# EAGLE design TZXDUINO (EAGLE 9.6.1)
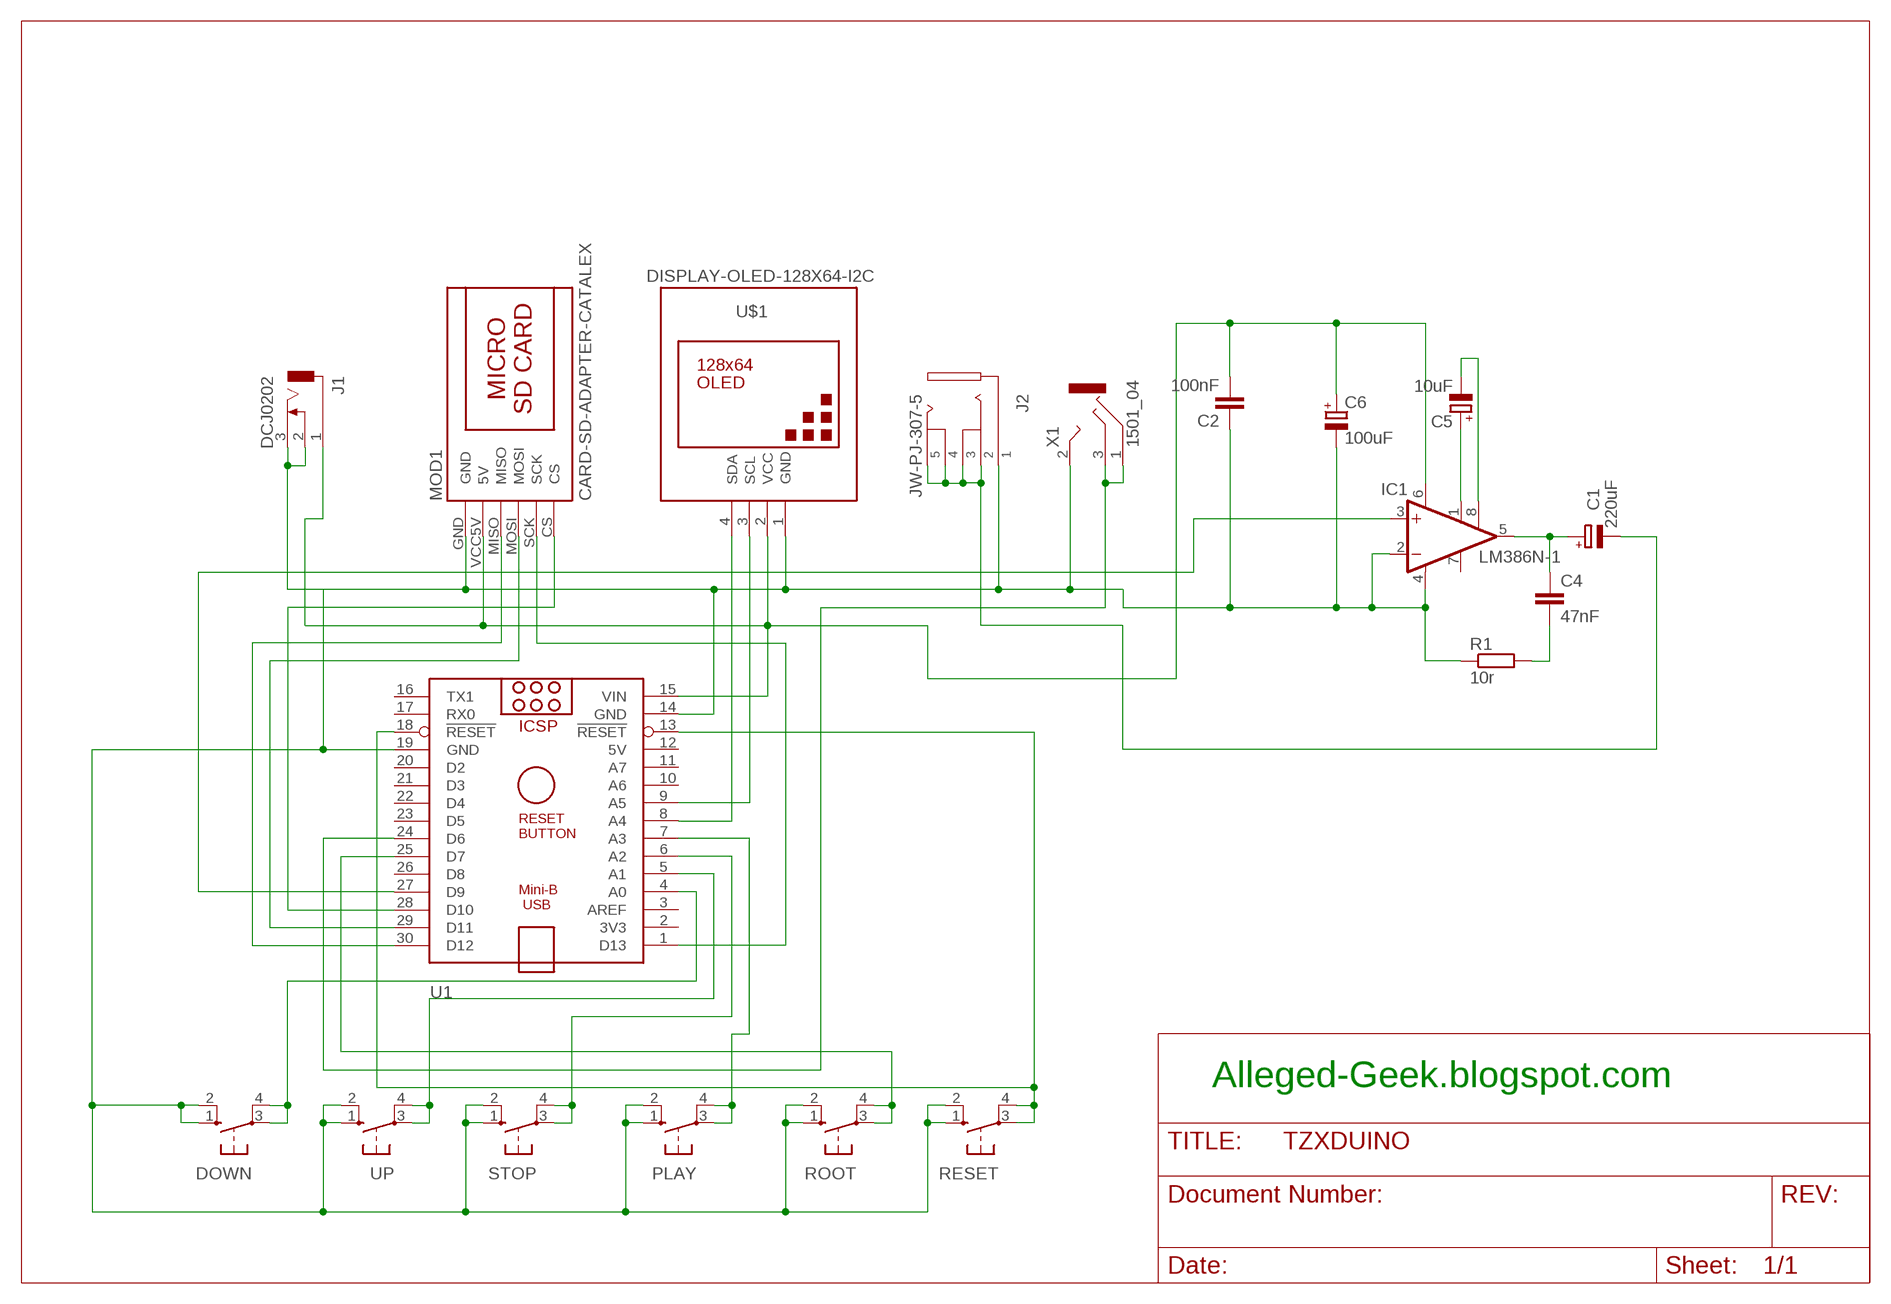
[diagram p0: schematic, sheet 1]

## Parts
C1  220uF  RGU-470UF-POLARCAP  [E3,5-8]
C2  100nF  RGU-CAPACITOR-CEU-50-25-75(100NF)  [C050-025X075]
C4  47nF  RGU-CAPACITOR-CEU-50-25-75(100NF)  [C050-025X075]
C5  10uF  RGU-10-100UF-POLARCAP  [E2,5-5]
C6  100uF  RGU-10-100UF-POLARCAP  [E2,5-5]
DOWN  10-XX  [B3F-10XX]
IC1  LM386N-1  [DIL08]
J1  DCJ0202  [DCJ0202]
J2  JW-PJ-307-5  [JW-PJ-307-5]
MOD1  CARD-SD-ADAPTER-CATALEX  [CARD-SD-ADAPTER-CATALEX]
PLAY  10-XX  [B3F-10XX]
R1  10r  RGU-RESISTOR-207/10  [0207/10]
RESET  10-XX  [B3F-10XX]
ROOT  10-XX  [B3F-10XX]
STOP  10-XX  [B3F-10XX]
U1  RGU-ARDUINONANO-SHIELD  [ARDUINO_NANO]
U$1  DISPLAY-OLED-128X64-I2C  [DISPLAY-OLED-128X64-I2C]
UP  10-XX  [B3F-10XX]
X1  1501_04  [1501_05]

## Nets
N$1: RESET.3(P) RESET.4(P1) U1.13(!RESET) U1.18(!RESET)
N$2: U1.8(A4) U$1.4(SDA)
N$3: C2.2 C6.+ IC1.6(VS) J1.1 MOD1.VCC5V(5V) U1.15(VIN) U$1.2(VCC)
N$4: MOD1.CS U1.28(D10)
N$5: MOD1.SCK U1.1(D13)
N$6: C1.- J2.2 J2.3 J2.4 J2.5
N$7: MOD1.MOSI U1.29(D11)
N$8: U1.9(A5) U$1.3(SCL)
N$9: MOD1.MISO U1.30(D12)
N$10: C2.1 C6.- DOWN.1(S) DOWN.2(S1) IC1.2(-IN) IC1.4(GND) J1.2 J1.3 J2.1 MOD1.GND PLAY.1(S) PLAY.2(S1) R1.1 RESET.1(S) RESET.2(S1) ROOT.1(S) ROOT.2(S1) STOP.1(S) STOP.2(S1) U1.14(GND) U1.19(GND) U$1.1(GND) UP.1(S) UP.2(S1) X1.2
N$11: DOWN.3(P) DOWN.4(P1) U1.4(A0)
N$12: U1.5(A1) UP.3(P) UP.4(P1)
N$13: STOP.3(P) STOP.4(P1) U1.6(A2)
N$14: PLAY.3(P) PLAY.4(P1) U1.7(A3)
N$15: ROOT.3(P) ROOT.4(P1) U1.25(D7)
N$17: IC1.3(+IN) U1.27(D9)
N$19: C5.+ IC1.1(GAIN)
N$20: C1.+ C4.1 IC1.5(OUT)
N$21: C4.2 R1.2
N$22: C5.- IC1.8(GAIN)
N$23: U1.24(D6) X1.1 X1.3
Unconnected: IC1.7(BYPASS) U1.2(3V3) U1.3(AREF) U1.10(A6) U1.11(A7) U1.16(TX1) U1.17(RX0) U1.20(D2) U1.21(D3) U1.22(D4) U1.23(D5) U1.26(D8)

## Notes on the sheet
- Alleged-Geek.blogspot.com

## Power pins joined to a net without a drawn wire
5V: U1.12(5V)

## Library data of the parts
C1 = RGU-StoresParts:RGU-470UF-POLARCAP
C2 C4 = RGU-StoresParts:RGU-CAPACITOR-CEU-50-25-75(100NF)
C5 C6 = RGU-StoresParts:RGU-10-100UF-POLARCAP
DOWN PLAY RESET ROOT STOP UP = switch-omron:10-XX: OMRON SWITCH; MPN: B3F-1000; OC_FARNELL: 176432; OC_NEWARK: 36M3542
IC1 = linear:LM386?-*: Low Voltage Audio Power Amplifier Source: http://cache.national.com/ds/LM/LM386.pdf
J1 = con-jack:DCJ0202: DC POWER JACK Source: DCJ0202.pdf; OC_FARNELL: unknown; OC_NEWARK: unknown
J2 = HeadphoneJack:JW-PJ-307-5
MOD1 = SD-Card-Module_CATALEX:CARD-SD-ADAPTER-CATALEX: Micro SD Card Adapter Module with onboard 3.3V regulator
R1 = RGU-StoresParts:RGU-RESISTOR-207/10
U1 = RGU-StoresParts:RGU-ARDUINONANO-SHIELD; MF: Rapid; MPN: 73-4448
U$1 = diy-modules:DISPLAY-OLED-128X64-I2C: 128x64 Dot Matrix OLED Module based on SSD1306 chip Variant with I2C interface More details available here: http://www.instructables.com/id/Monochrome-096-i2c-OLED-display-with-arduino-SSD13/ SSD1306 datasheet: https://cdn-shop.adafruit.com/datasheets/SSD1306.pdf Click here to find device on ebay.com <http://www.ebay.com/sch/oled+display+128x64+iic> Note: There are two variants: I2C and SPI. Search for the proper version.
X1 = con-lumberg:1501_0*: Jack connectors according to JISC 6560, 2.5 mm Klinkensteckverbinder nach JISC 6560, 2,5 mm Source: http://www.lumberg.com/Produkte/PDFs/1501_05.pdfedit 1501_03 http://www.lumberg.com/Produkte/PDFs/1501_06.pdf; OC_FARNELL: 1216977; OC_NEWARK: unknown

## Board
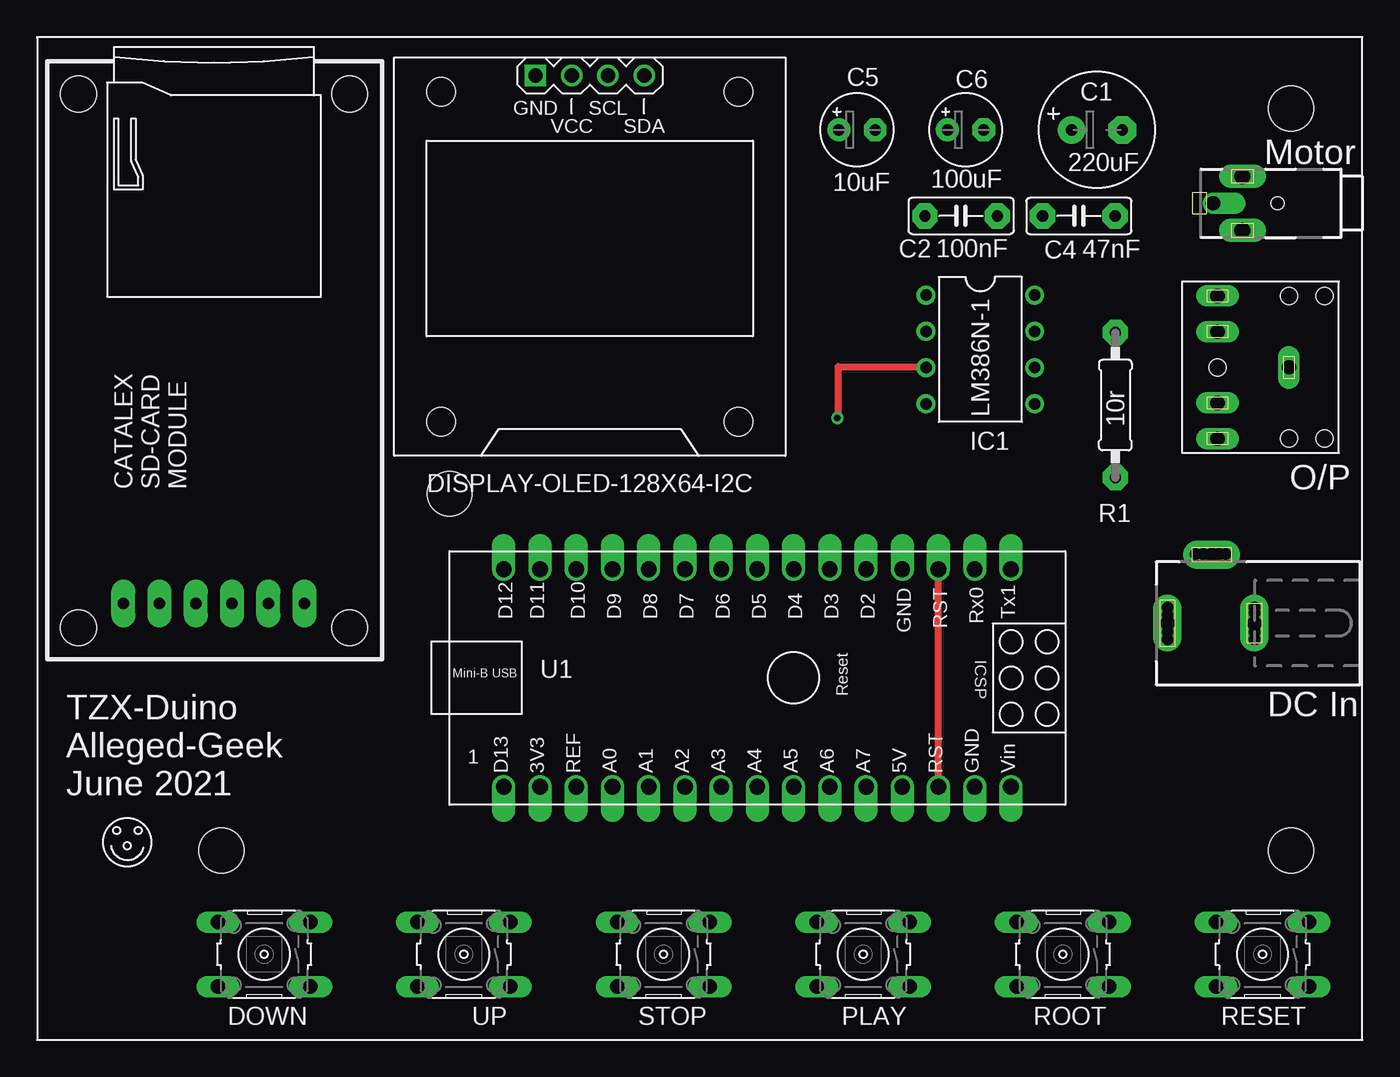
[diagram p1: board, top side]
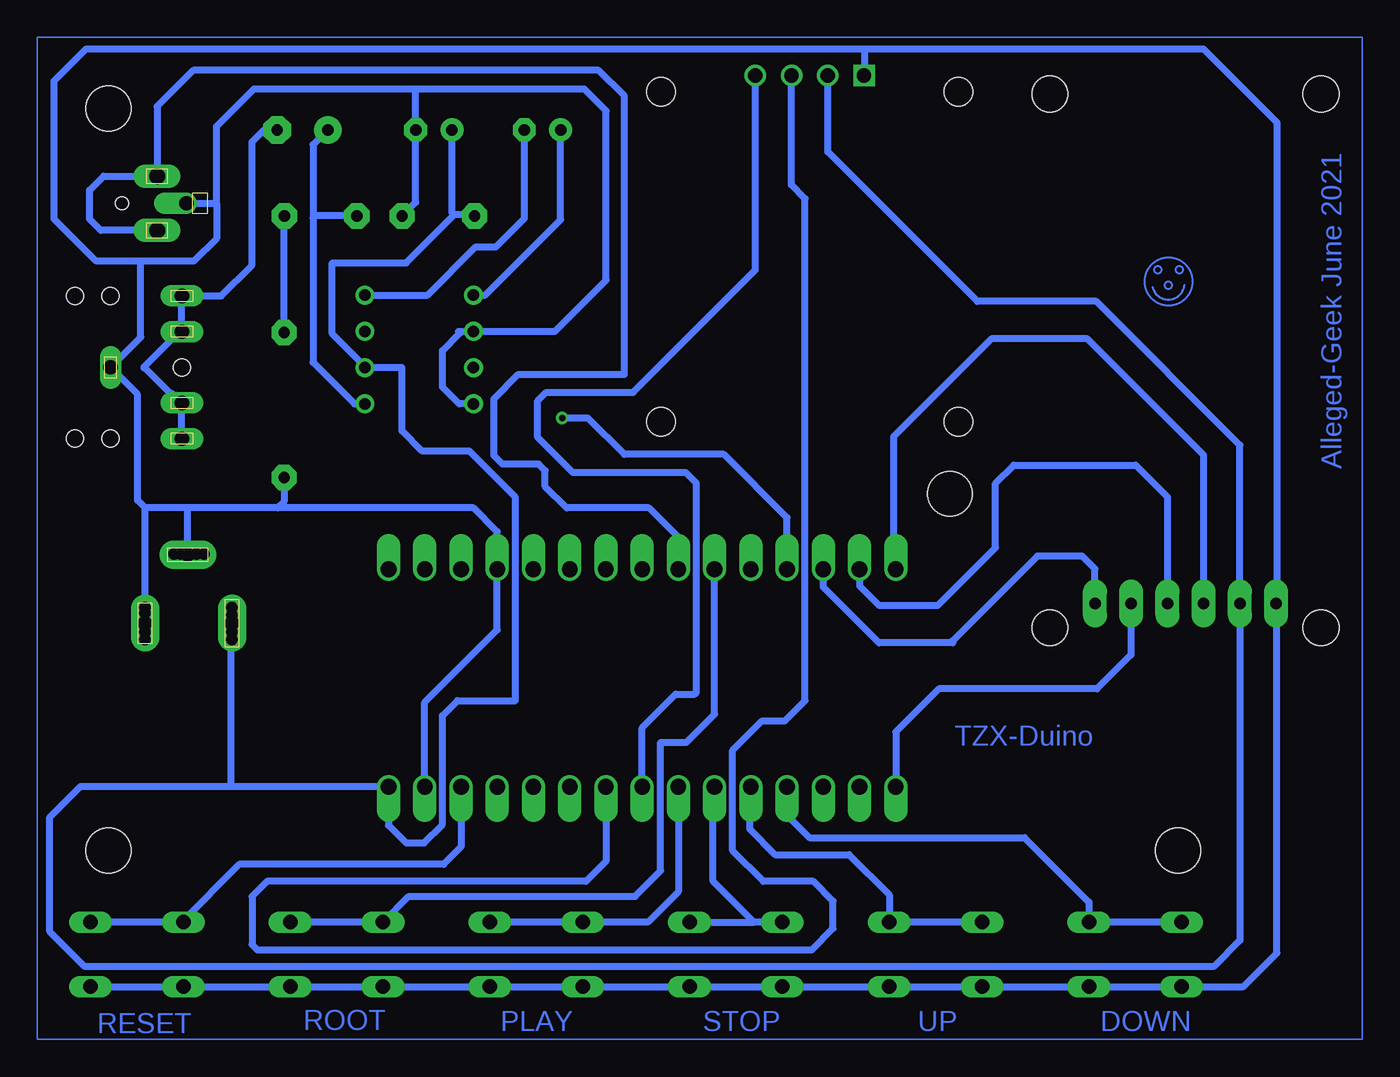
[diagram p2: board, bottom side, seen from below]

Size 6.15 x 10.8 mm. Coordinates in mm from the lower left corner, seen from the top.
Copper layers (1*16): Top 0.035mm / dielectric 1.5mm / Bottom 0.035mm
Design rules "default": minimum track width 6mil, minimum drill 0.35mm, track to track 6mil, track to pad 6mil, pad to pad 6mil, via to via 6mil, smd to smd 6mil, copper to edge 40mil, drill to drill 6mil, minimum pad ring 10mil, minimum via ring 8mil, stop-mask expansion 4mil, vias tented up to drill 0mil, thermal gap 10mil
Holes 3.15 mm at -69.1,-28.46 5.9,-28.46 5.9,23.54 -53.1,-3.46

### Footprints (pad centres in the part's own frame; a part is rotated, then mirrored left to right if it is on the bottom)
E3,5-8 = drill 0.8 pad 1.93: + -1.778,0 | drill 0.8 pad 1.93 octagon: - 1.778,0
C050-025X075 = drill 0.8 pad 1.778 octagon: 1 -2.54,0; 2 2.54,0
E2,5-5 = drill 0.8 pad 1.6: + -1.27,0 | drill 0.8 pad 1.6 octagon: - 1.27,0
B3F-10XX = drill 1.016 long: 1 -3.251,2.261; 2 3.251,2.261; 3 -3.251,-2.261; 4 3.251,-2.261
DIL08 = drill 0.813 pad 1.27: 1 -3.81,-3.81; 2 -1.27,-3.81; 3 1.27,-3.81; 4 3.81,-3.81; 5 3.81,3.81; 6 1.27,3.81; 7 -1.27,3.81; 8 -3.81,3.81
DCJ0202 = drill 1 pad 2 long: 1 0,3.1; 2 4.8,0; 3 0,-3
JW-PJ-307-5 = drill 1 pad 1.422 long: 1 -2,0; 2 3,5; 3 3,2.5; 4 3,-2.5; 5 3,-5 | hole 1.2: -4.5,5; -2,5; 3,0; -4.5,-5; -2,-5
CARD-SD-ADAPTER-CATALEX = drill 0.8 pad 1.676 long: CS -17,-6.35; GND -17,6.35; MISO -17,1.27; MOSI -17,-1.27; SCK -17,-3.81; VCC5V -17,3.81 | hole 2.5: -18.7,9.5; 18.7,9.5; 18.7,-9.5; -18.7,-9.5
0207/10 = drill 0.8 pad 1.778 octagon: 1 -5.08,0; 2 5.08,0
ARDUINO_NANO = drill 1.1 offset: 1 -20.32,-7.62; 2 -17.78,-7.62; 3 -15.24,-7.62; 4 -12.7,-7.62; 5 -10.16,-7.62; 6 -7.62,-7.62; 7 -5.08,-7.62; 8 -2.54,-7.62; 9 0,-7.62; 10 2.54,-7.62; 11 5.08,-7.62; 12 7.62,-7.62; 13 10.16,-7.62; 14 12.7,-7.62; 15 15.24,-7.62; 16 15.24,7.62; 17 12.7,7.62; 18 10.16,7.62; 19 7.62,7.62; 20 5.08,7.62; 21 2.54,7.62; 22 0,7.62; 23 -2.54,7.62; 24 -5.08,7.62; 25 -7.62,7.62; 26 -10.16,7.62; 27 -12.7,7.62; 28 -15.24,7.62; 29 -17.78,7.62; 30 -20.32,7.62
DISPLAY-OLED-128X64-I2C = drill 1 square: 1 -3.81,12.7 | drill 1: 2 -1.27,12.7; 3 1.27,12.7; 4 3.81,12.7 | hole 2: -10.414,11.557; 10.414,11.557; 10.414,-11.557; -10.414,-11.557
1501_05 = drill 1.1 pad 1.4 long: 1 -1.9,-8.5; 3 1.9,-8.5 | drill 1 pad 1.27 offset: 2 0,-10.547 | hole 0.9: 0,-6.032

### Placement (x,y rotation side)
C1  -7.71,22.05 0 top  (outside the outline)
C2  -17.23,16.01 180 top  (outside the outline)
C4  -8.98,16.01 0 top  (outside the outline)
C5  -24.53,22.05 0 top  (outside the outline)
C6  -16.91,22.05 0 top  (outside the outline)
DOWN  -66.1,-35.74 180 top  (outside the outline)
DRILEGEND  [DRILEGEND]  -86.92,-45.62 0 top  (outside the outline)
IC1  -15.89,6.65 270 top  (outside the outline)
J1  0.34,-12.53 90 top  (outside the outline)
J2  3.75,5.4 180 top
MOD1  -69.62,5.85 90 top  (outside the outline)
PLAY  -24.1,-35.74 180 top  (outside the outline)
R1  -6.42,2.75 90 top  (outside the outline)
RESET  3.9,-35.74 180 top  (outside the outline)
ROOT  -10.1,-35.74 180 top  (outside the outline)
STOP  -38.1,-35.74 180 top  (outside the outline)
U1  -28.98,-16.37 0 top  (outside the outline)
U$1  -43.27,13.16 0 top  (outside the outline)
UP  -52.1,-35.74 180 top  (outside the outline)
X1  10.98,16.9 270 top  (outside the outline)

### Tracks (layer width: path | path; a pad name or v marks a point on that pad's centre or on a via)
N$1
  Top 0.508: U1.13 U1.18
  Bottom 0.305: 0.78,-33.48 RESET.4 0.23,-33.48
  Bottom 0.508: U1.13 -18.82,-28.21 -17.6,-29.43 -3.27,-29.43 0.78,-33.48 | RESET.4 RESET.3
N$2
  Bottom 0.508: U1.8 -31.52,-19.86 -33.87,-17.51 -35.22,-17.51 -35.33,-17.4 -35.33,-2.72 -34.59,-1.98 -26.67,-1.98 -24.2,0.49 -24.2,3.04 -24.8,3.64 -30.87,3.64 | -30.87,3.64 -30.88,3.63 | -30.87,3.64 -39.46,12.23 U$1.4
N$3
  Bottom 0.254: J1.1 -2.63,-12.67
  Bottom 0.508: -2.67,-23.99 U1.15 -13.74,-26.7 -14.97,-27.93 -16.25,-27.93 -17.52,-26.66 -17.52,-19.01 -18.57,-17.96 -22.63,-17.96 -22.63,-3.71 -19.4,-0.48 -16.1,-0.48 -14.67,0.94 -14.67,5.38 IC1.6 -12.08,5.49 -9.8,7.77 -9.8,12.72 -14.97,12.72 -18.35,16.09 | -2.67,-23.99 7.86,-23.99 10,-26.13 10,-34.16 7.56,-36.6 -71.6,-36.6 -73.43,-34.77 MOD1.VCC5V -73.43,-0.06 -63.35,10.02 -55.02,10.02 -44.54,20.5 U$1.2 | J1.1 -2.67,-12.62 -2.67,-23.99 | -18.35,16.09 -19.69,16.09 C2.2 | -18.35,16.09 -18.18,16.26 C6.+
N$4
  Bottom 0.508: MOD1.CS -63.27,-8.73 -62.37,-7.83 -59.22,-7.83 -53.3,-13.76 -53.3,-13.91 -48.12,-13.91 -44.22,-10 U1.28
N$5
  Bottom 0.508: MOD1.SCK -65.79,-11.17 -65.79,-14.75 -63.41,-17.13 -52.32,-17.13 -49.3,-20.16 U1.1
N$6
  Bottom 0.305: 1.39,2.9 J2.3 | J2.4 0.93,7.9 2.02,7.9
  Bottom 0.508: J2.2 J2.3 1.38,3.53 1.53,3.53 3.36,5.37 3.4,5.37 3.4,5.42 0.93,7.9 | J2.4 J2.5 -2.01,10.4 -4.17,12.57 -4.17,21.19 -5.03,22.05 C1.-
N$7
  Bottom 0.508: U1.29 -46.76,-9.92 -48.12,-11.28 -52.25,-11.28 -56.3,-7.23 -56.3,-2.73 -57.57,-1.46 -66.12,-1.46 -68.35,-3.68 MOD1.MOSI
N$8
  Bottom 0.508: U1.9 -28.98,-29.23 -27.57,-30.63 -5.22,-30.63 -4.17,-31.68 -4.17,-35.06 -4.53,-35.42 -43.41,-35.42 -44.9,-33.93 -44.9,-32.01 -43.52,-30.63 -40.02,-30.63 -37.87,-28.48 -37.87,-21.45 -39.94,-19.38 -41.52,-19.38 -42.95,-17.96 -42.95,17.22 -41.97,18.19 -41.97,25.83 U$1.3
N$9
  Bottom 0.508: MOD1.MISO -70.89,-0.75 -62.75,7.39 -56,7.39 -49.15,0.54 -49.15,-8.6 U1.30
N$10
  Bottom 0.305: MOD1.GND -75.97,-10.98 | 5.66,5.4 J2.1 5.75,5.61 | -21.36,-8.43 U1.19 | DOWN.2 -69.65,-38
  Bottom 0.508: RESET.1 RESET.2 ROOT.1 ROOT.2 PLAY.1 PLAY.2 STOP.1 STOP.2 UP.1 UP.2 DOWN.1 -69.65,-38 | DOWN.2 -73.68,-38 -76.02,-35.66 -76.02,-11.04 | -76.02,-11.04 -75.97,-10.98 | U1.14 -16.28,-18.08 -21.36,-13 -21.36,-8.43 | U1.19 -21.36,-6.12 -19.7,-4.46 -5.97,-4.46 | 3.33,-4.46 3.85,-3.93 3.85,3.5 J2.1 3.63,7.52 3.63,12.84 | -5.97,-4.46 0.4,-4.46 | 0.4,-4.46 3.33,-4.46 | J1.3 3.34,-4.47 3.33,-4.46 | J1.2 0.34,-4.52 0.4,-4.46 | R1.1 -6.42,-4.01 -5.97,-4.46 | IC1.4 -18.7,2.84 -17.52,4.02 -17.52,6.57 -18.76,7.81 -18.65,7.92 IC1.2 -25.4,7.92 -29,11.52 -29,23.37 -27.46,24.9 -15.64,24.9 | C2.1 -15.64,16.96 C6.- -15.64,24.9 | -15.64,24.9 -4.28,24.9 -1.67,22.29 -1.67,16.9 | X1.2 -1.67,16.9 | -1.67,16.9 -1.67,14.42 -0.09,12.84 3.63,12.84 | 3.63,12.84 6.75,12.84 9.7,15.79 9.7,25.47 7.45,27.72 -47.15,27.72 | -47.15,27.72 -70.87,27.72 -76.02,22.56 -76.02,-11.04 | U$1.1 -47.15,25.93 -47.15,27.72
N$11
  Bottom 0.305: DOWN.3 -62.63,-33.4
  Bottom 0.508: U1.4 -41.68,-25.99 -43.25,-27.56 -58.32,-27.56 -62.85,-32.08 DOWN.3 DOWN.4
N$12
  Bottom 0.508: U1.5 -39.05,-24.08 -39.05,-26.96 -40.85,-28.76 -46.02,-28.76 -48.85,-31.58 UP.3 UP.4
N$13
  Bottom 0.508: STOP.4 -39.35,-33.48 | -39.35,-33.48 -36.5,-30.63 -36.5,-24.09 U1.6 | STOP.3 -39.35,-33.48
N$14
  Bottom 0.305: -27.2,-33.48 PLAY.4
  Bottom 0.508: U1.7 -34.06,-31.35 -31.92,-33.48 -27.2,-33.48 | PLAY.4 PLAY.3
N$15
  Bottom 0.305: ROOT.4 -13.42,-33.48
  Bottom 0.508: ROOT.3 ROOT.4 -15.15,-31.68 -31.02,-31.68 -32.82,-29.88 -32.82,-20.89 -34.61,-20.89 -36.6,-18.91 U1.25
N$16
  Bottom 0.102: -82.02,28.54 10.9,28.54 10.9,-41.71 -82.02,-41.71 -82.02,28.54
N$17  (via drill 0.45)
  Top 0.508: v-25.91,1.84 -25.85,1.91 -25.85,5.44 -19.76,5.44 IC1.3
  Bottom 0.254: IC1.3 -19.7,5.36
  Bottom 0.508: U1.27 -41.68,-5.14 -37.25,-0.71 -30.27,-0.71 -27.72,1.84 v-25.91,1.84
N$18  (via drill 0.8)
  other vias: -2.75,-11.96
N$19
  Bottom 0.508: IC1.1 -20.52,10.46 -25.8,15.75 C5.+
N$20
  Bottom 0.508: C1.+ -8.45,21.01 -8.45,15.87 | -8.45,15.87 -8.45,5.74 -11.35,2.84 IC1.5 | C4.1 -8.59,16.01 -8.45,15.87
N$21
  Bottom 0.305: C4.2
  Bottom 0.508: R1.2 -6.42,15.99 C4.2
N$22
  Bottom 0.508: IC1.8 -16.47,10.46 -19.85,13.84 -21.27,13.84 -23.26,15.83 C5.-
N$23
  Bottom 0.508: U1.24 -34.06,-6.52 -32,-4.46 -26.22,-4.46 -24.72,-2.96 -24.72,-1.83 -24.27,-1.38 -21.72,-1.38 -21.12,-0.78 -21.12,3.19 -22.83,4.9 -30.27,4.9 -30.27,24.42 -28.47,26.22 -0.05,26.22 2.48,23.68 X1.1 6.25,18.8 7.23,17.82 7.23,15.79 6.43,15 X1.3
N$24
  Bottom 0.127: -67.3,11.04 arc-161 -69.55,11.17
N$31  (via drill 0.8)
  other vias: -2.75,-11.43
N$32  (via drill 0.8)
  other vias: -2.75,-13.16
N$33  (via drill 0.8)
  other vias: -2.75,-13.68
N$34  (via drill 0.8)
  other vias: 3.33,-13.68
N$35  (via drill 0.8)
  other vias: 3.33,-13.16
N$36  (via drill 0.8)
  other vias: 3.33,-11.81
N$37  (via drill 0.8)
  other vias: 3.33,-11.43
N$38  (via drill 0.8)
  other vias: 0.85,-7.68
N$39  (via drill 0.8)
  other vias: 1.3,-7.68
N$40  (via drill 0.8)
  other vias: -0.27,-7.68
N$41  (via drill 0.8)
  other vias: -0.8,-7.68
(copper drawn outside any net)
  shapes: Bottom circle x4

### Text on the board
Bottom: Alleged-Geek June 2021 | TZX-Duino | DOWN | UP | STOP | PLAY | ROOT | RESET
tPlace: Motor | O/P | DC In | TZX-Duino / Alleged-Geek / June 2021
DrillLegend: LAYER-STACK
DrillLegend_01-16: 01-16
DrillLegend_01-20: 01-20